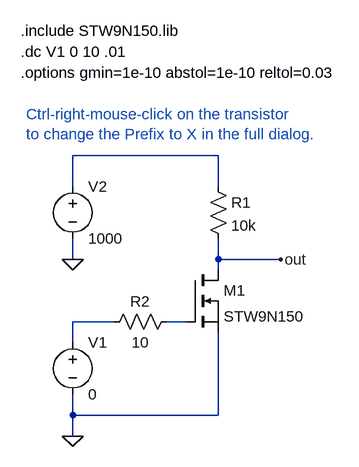
[diagram p0: schematic STW9N150_test.asc]
STW9N150_test.asc, the LTspice schematic file:
Version 4
SHEET 1 880 680
WIRE 208 -80 -16 -80
WIRE -16 -32 -16 -80
WIRE 208 -32 208 -80
WIRE -16 80 -16 48
WIRE 208 80 208 48
WIRE 304 80 208 80
WIRE 208 96 208 80
WIRE 48 176 -16 176
WIRE 160 176 128 176
WIRE -16 208 -16 176
WIRE -16 320 -16 288
WIRE 208 320 208 192
WIRE 208 320 -16 320
WIRE -16 352 -16 320
FLAG -16 352 0
FLAG -16 80 0
FLAG 304 80 out
SYMBOL nmos 160 96 R0
SYMATTR InstName M1
SYMATTR Value STW9N150
SYMATTR Prefix X
SYMBOL res 192 -48 R0
SYMATTR InstName R1
SYMATTR Value 10k
SYMBOL voltage -16 192 R0
SYMATTR InstName V1
SYMATTR Value 0
SYMBOL voltage -16 -48 R0
SYMATTR InstName V2
SYMATTR Value 1000
SYMBOL res 32 192 R270
WINDOW 0 32 56 VTop 0
WINDOW 3 0 56 VBottom 0
SYMATTR InstName R2
SYMATTR Value 10
TEXT -88 -144 Left 0 ;Ctrl-right-mouse-click on the transistor\nto change the Prefix to X in the full dialog.
TEXT -96 -240 Left 0 !.dc V1 0 10 .01
TEXT -96 -272 Left 0 !.include STW9N150.lib
TEXT -96 -208 Left 0 !.options gmin=1e-10 abstol=1e-10 reltol=0.03

The netlist it stands for:
* STW9N150_test.asc
XM1 out N003 0 STW9N150  ; pins D G S
R1 N001 out 10k
V1 N002 0 0
V2 N001 0 1000
R2 N002 N003 10
* Ctrl-right-mouse-click on the transistor
* to change the Prefix to X in the full dialog.
.dc V1 0 10 .01
.include STW9N150.lib
.options gmin=1e-10 abstol=1e-10 reltol=0.03
.backanno
.end